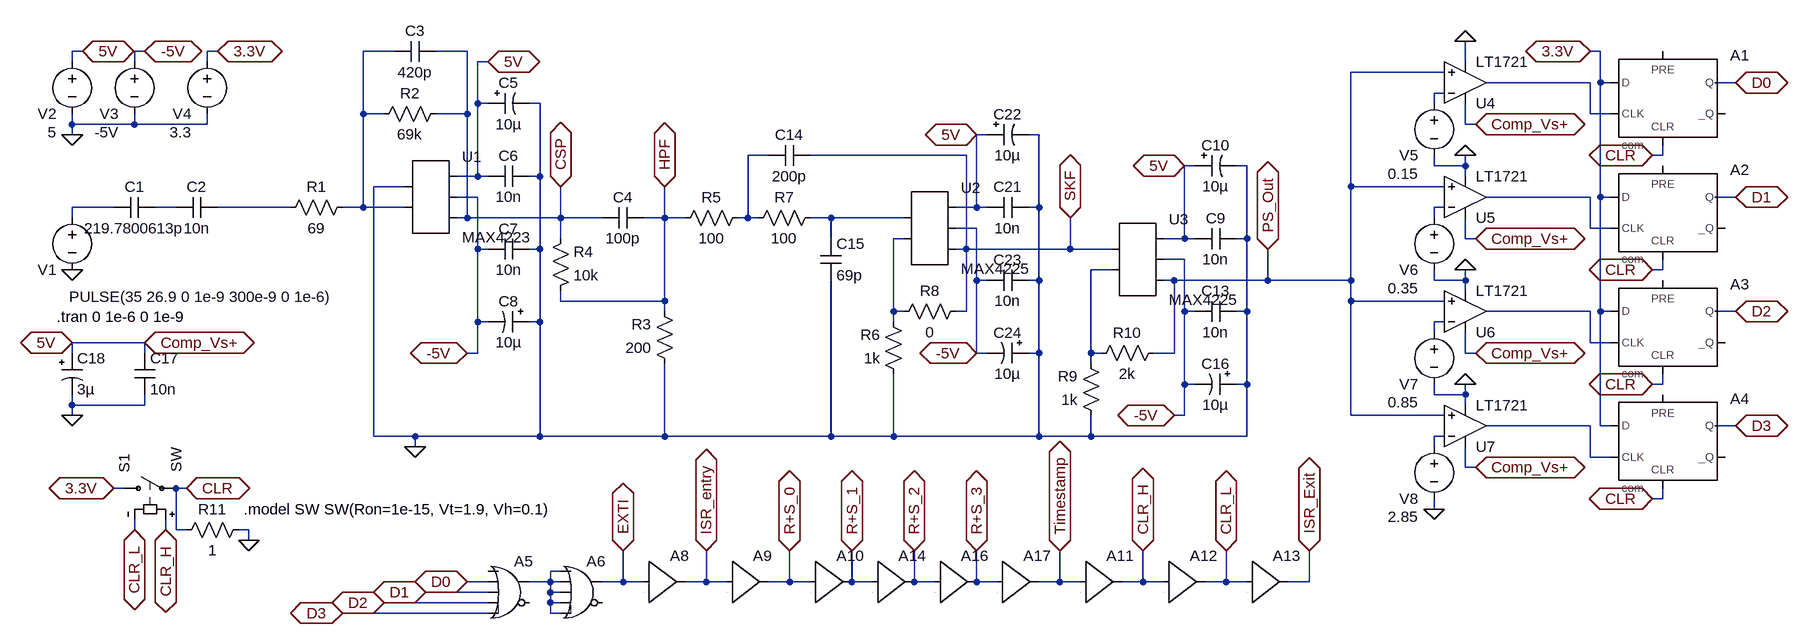
[diagram p0: schematic Radiation_to_OBC.asc]
Radiation_to_OBC.asc, the LTspice schematic file:
Version 4
SHEET 1 8136 1524
WIRE -496 -176 -512 -176
WIRE -400 -176 -416 -176
WIRE -288 -176 -304 -176
WIRE -16 -176 -64 -176
WIRE 96 -176 48 -176
WIRE 1840 -176 1824 -176
WIRE -512 -160 -512 -176
WIRE -416 -160 -416 -176
WIRE -304 -160 -304 -176
WIRE 128 -160 112 -160
WIRE 1632 -160 1632 -192
WIRE 1600 -144 1456 -144
WIRE 1824 -128 1664 -128
WIRE 1840 -128 1840 -176
WIRE 1856 -128 1840 -128
WIRE 2048 -128 2016 -128
WIRE 1600 -112 1584 -112
WIRE 112 -96 112 -160
WIRE 128 -96 112 -96
WIRE 208 -96 192 -96
WIRE 1584 -96 1584 -112
WIRE -64 -80 -64 -176
WIRE -32 -80 -64 -80
WIRE 96 -80 96 -176
WIRE 96 -80 48 -80
WIRE 1824 -80 1824 -128
WIRE 1856 -80 1824 -80
WIRE -512 -64 -512 -80
WIRE -416 -64 -416 -80
WIRE -416 -64 -512 -64
WIRE -304 -64 -304 -80
WIRE -304 -64 -416 -64
WIRE 1632 -64 1632 -96
WIRE 1648 -64 1632 -64
WIRE -512 -48 -512 -64
WIRE 896 -48 880 -48
WIRE 976 -48 960 -48
WIRE 560 -16 528 -16
WIRE 864 -16 624 -16
WIRE 1936 -16 1936 -32
WIRE 1936 -16 1920 -16
WIRE 1216 0 1200 0
WIRE 1296 0 1280 0
WIRE 1584 0 1584 -16
WIRE 1632 0 1632 -16
WIRE 1632 0 1584 0
WIRE 112 16 112 -96
WIRE 112 16 80 16
WIRE 128 16 112 16
WIRE 208 16 208 -96
WIRE 208 16 192 16
WIRE 1632 16 1632 0
WIRE 0 32 -48 32
WIRE 1456 32 1456 -144
WIRE 1600 32 1456 32
WIRE 112 48 80 48
WIRE 1824 48 1664 48
WIRE 1840 48 1840 -128
WIRE 1856 48 1840 48
WIRE 2048 48 2016 48
WIRE -448 64 -512 64
WIRE -352 64 -384 64
WIRE -176 64 -288 64
WIRE -64 64 -64 -80
WIRE -64 64 -96 64
WIRE 0 64 -64 64
WIRE 880 64 880 -48
WIRE 880 64 848 64
WIRE 896 64 880 64
WIRE 976 64 976 -48
WIRE 976 64 960 64
WIRE 1600 64 1584 64
WIRE -512 80 -512 64
WIRE 96 80 96 -80
WIRE 96 80 80 80
WIRE 240 80 240 32
WIRE 240 80 96 80
WIRE 304 80 240 80
WIRE 400 80 400 32
WIRE 400 80 368 80
WIRE 432 80 400 80
WIRE 528 80 528 -16
WIRE 528 80 512 80
WIRE 544 80 528 80
WIRE 656 80 624 80
WIRE 768 80 656 80
WIRE 1584 80 1584 64
WIRE 880 96 848 96
WIRE 1824 96 1824 48
WIRE 1856 96 1824 96
WIRE 240 112 240 80
WIRE 656 112 656 80
WIRE 768 112 752 112
WIRE 1200 112 1200 0
WIRE 1200 112 1168 112
WIRE 1216 112 1200 112
WIRE 1296 112 1296 0
WIRE 1296 112 1280 112
WIRE 1632 112 1632 80
WIRE 1648 112 1632 112
WIRE 112 128 112 48
WIRE 128 128 112 128
WIRE 208 128 208 16
WIRE 208 128 192 128
WIRE 864 128 864 -16
WIRE 864 128 848 128
WIRE 1024 128 1024 80
WIRE 1024 128 864 128
WIRE 1088 128 1024 128
WIRE 1200 144 1168 144
WIRE 1088 160 1056 160
WIRE 1936 160 1936 144
WIRE 1936 160 1920 160
WIRE 880 176 880 96
WIRE 896 176 880 176
WIRE 976 176 976 64
WIRE 976 176 960 176
WIRE 1184 176 1168 176
WIRE 1328 176 1328 128
WIRE 1328 176 1184 176
WIRE 1456 176 1456 32
WIRE 1456 176 1328 176
WIRE 1584 176 1584 160
WIRE 1632 176 1632 160
WIRE 1632 176 1584 176
WIRE 1632 192 1632 176
WIRE 240 208 240 192
WIRE 400 208 400 80
WIRE 400 208 240 208
WIRE 1456 208 1456 176
WIRE 1600 208 1456 208
WIRE 400 224 400 208
WIRE 752 224 752 112
WIRE 768 224 752 224
WIRE 864 224 864 128
WIRE 864 224 848 224
WIRE 1200 224 1200 144
WIRE 1216 224 1200 224
WIRE 1296 224 1296 112
WIRE 1296 224 1280 224
WIRE 1824 224 1664 224
WIRE 1840 224 1840 48
WIRE 1856 224 1840 224
WIRE 2048 224 2016 224
WIRE 112 240 112 128
WIRE 128 240 112 240
WIRE 208 240 208 128
WIRE 208 240 192 240
WIRE 752 240 752 224
WIRE 1600 240 1584 240
WIRE 1584 256 1584 240
WIRE -400 272 -512 272
WIRE 1824 272 1824 224
WIRE 1856 272 1824 272
WIRE -512 288 -512 272
WIRE -400 288 -400 272
WIRE 112 288 112 240
WIRE 112 288 96 288
WIRE 880 288 880 176
WIRE 896 288 880 288
WIRE 976 288 976 176
WIRE 976 288 960 288
WIRE 1056 288 1056 160
WIRE 1072 288 1056 288
WIRE 1184 288 1184 176
WIRE 1184 288 1152 288
WIRE 1632 288 1632 256
WIRE 1648 288 1632 288
WIRE 1056 304 1056 288
WIRE 1200 336 1200 224
WIRE 1216 336 1200 336
WIRE 1296 336 1296 224
WIRE 1296 336 1280 336
WIRE 1936 336 1936 320
WIRE 1936 336 1920 336
WIRE 1584 352 1584 336
WIRE 1632 352 1632 336
WIRE 1632 352 1584 352
WIRE -512 368 -512 352
WIRE -400 368 -400 352
WIRE -400 368 -512 368
WIRE 1632 368 1632 352
WIRE -512 384 -512 368
WIRE 1200 384 1200 336
WIRE 1200 384 1184 384
WIRE 1456 384 1456 208
WIRE 1600 384 1456 384
WIRE 1824 400 1664 400
WIRE 1840 400 1840 224
WIRE 1856 400 1840 400
WIRE 2048 400 2016 400
WIRE -48 416 -48 32
WIRE 16 416 -48 416
WIRE 208 416 208 240
WIRE 208 416 16 416
WIRE 400 416 400 304
WIRE 400 416 208 416
WIRE 656 416 656 176
WIRE 656 416 400 416
WIRE 752 416 752 320
WIRE 752 416 656 416
WIRE 976 416 976 288
WIRE 976 416 752 416
WIRE 1056 416 1056 384
WIRE 1056 416 976 416
WIRE 1296 416 1296 336
WIRE 1296 416 1056 416
WIRE 1600 416 1584 416
WIRE 16 432 16 416
WIRE 1584 432 1584 416
WIRE 1824 448 1824 400
WIRE 1856 448 1824 448
WIRE 1632 464 1632 432
WIRE 1648 464 1632 464
WIRE -432 496 -448 496
WIRE -336 496 -352 496
WIRE 1936 512 1936 496
WIRE 1936 512 1920 512
WIRE 1584 528 1584 512
WIRE -416 560 -416 544
WIRE -368 560 -368 544
WIRE -352 560 -352 496
WIRE -336 560 -352 560
WIRE -240 560 -256 560
WIRE -240 576 -240 560
WIRE 240 624 224 624
WIRE 128 640 96 640
WIRE 224 640 224 624
WIRE 224 640 192 640
WIRE 240 640 224 640
WIRE 336 640 336 592
WIRE 336 640 304 640
WIRE 368 640 336 640
WIRE 464 640 464 592
WIRE 464 640 432 640
WIRE 496 640 464 640
WIRE 592 640 592 592
WIRE 592 640 560 640
WIRE 624 640 592 640
WIRE 688 640 688 592
WIRE 720 640 688 640
WIRE 784 640 784 592
WIRE 816 640 784 640
WIRE 880 640 880 592
WIRE 912 640 880 640
WIRE 1008 640 1008 592
WIRE 1008 640 976 640
WIRE 1040 640 1008 640
WIRE 1136 640 1136 592
WIRE 1136 640 1104 640
WIRE 1168 640 1136 640
WIRE 1264 640 1264 592
WIRE 1264 640 1232 640
WIRE 1296 640 1264 640
WIRE 1392 640 1392 592
WIRE 1392 640 1360 640
WIRE 128 656 32 656
WIRE 224 656 224 640
WIRE 240 656 224 656
WIRE 128 672 -32 672
WIRE 224 672 224 656
WIRE 240 672 224 672
WIRE 128 688 -96 688
WIRE 224 688 224 672
WIRE 240 688 224 688
FLAG -512 -48 0
FLAG -512 160 0
FLAG 16 432 0
FLAG 1328 128 PS_Out
IOPIN 1328 128 BiDir
FLAG 400 32 HPF
IOPIN 400 32 BiDir
FLAG 1024 80 SKF
IOPIN 1024 80 BiDir
FLAG -496 -176 5V
IOPIN -496 -176 BiDir
FLAG -400 -176 -5V
IOPIN -400 -176 BiDir
FLAG -288 -176 3.3V
IOPIN -288 -176 BiDir
FLAG 96 288 -5V
IOPIN 96 288 BiDir
FLAG 880 288 -5V
IOPIN 880 288 BiDir
FLAG 1184 384 -5V
IOPIN 1184 384 BiDir
FLAG 880 -48 5V
IOPIN 880 -48 BiDir
FLAG 1200 0 5V
IOPIN 1200 0 BiDir
FLAG 128 -160 5V
IOPIN 128 -160 BiDir
FLAG -512 272 5V
IOPIN -512 272 BiDir
FLAG -512 384 0
FLAG -400 272 Comp_Vs+
IOPIN -400 272 BiDir
FLAG 1648 -64 Comp_Vs+
IOPIN 1648 -64 BiDir
FLAG 1648 112 Comp_Vs+
IOPIN 1648 112 BiDir
FLAG 1648 288 Comp_Vs+
IOPIN 1648 288 BiDir
FLAG 1648 464 Comp_Vs+
IOPIN 1648 464 BiDir
FLAG 1584 528 0
FLAG 1632 -16 0
FLAG 1632 160 0
FLAG 1632 336 0
FLAG 240 32 CSP
IOPIN 240 32 BiDir
FLAG 1824 -176 3.3V
IOPIN 1824 -176 BiDir
FLAG 1920 -16 CLR
IOPIN 1920 -16 BiDir
FLAG 1920 160 CLR
IOPIN 1920 160 BiDir
FLAG 1920 336 CLR
IOPIN 1920 336 BiDir
FLAG 1920 512 CLR
IOPIN 1920 512 BiDir
FLAG 336 592 EXTI
IOPIN 336 592 BiDir
FLAG 464 592 ISR_entry
IOPIN 464 592 BiDir
FLAG -448 496 3.3V
IOPIN -448 496 BiDir
FLAG 592 592 R+S_0
IOPIN 592 592 BiDir
FLAG 1008 592 Timestamp
IOPIN 1008 592 BiDir
FLAG -240 576 0
FLAG -336 496 CLR
IOPIN -336 496 BiDir
FLAG -368 560 CLR_H
IOPIN -368 560 BiDir
FLAG 1136 592 CLR_H
IOPIN 1136 592 BiDir
FLAG -416 560 CLR_L
IOPIN -416 560 BiDir
FLAG 1264 592 CLR_L
IOPIN 1264 592 BiDir
FLAG 1392 592 ISR_Exit
IOPIN 1392 592 BiDir
FLAG 1632 -192 0
FLAG 688 592 R+S_1
IOPIN 688 592 BiDir
FLAG 784 592 R+S_2
IOPIN 784 592 BiDir
FLAG 880 592 R+S_3
IOPIN 880 592 BiDir
FLAG 2048 -128 D0
IOPIN 2048 -128 BiDir
FLAG 2048 48 D1
IOPIN 2048 48 BiDir
FLAG 2048 224 D2
IOPIN 2048 224 BiDir
FLAG 2048 400 D3
IOPIN 2048 400 BiDir
FLAG -96 688 D3
IOPIN -96 688 BiDir
FLAG -32 672 D2
IOPIN -32 672 BiDir
FLAG 32 656 D1
IOPIN 32 656 BiDir
FLAG 96 640 D0
IOPIN 96 640 BiDir
SYMBOL res -80 48 R90
WINDOW 0 0 56 VBottom 2
WINDOW 3 32 56 VTop 2
SYMATTR InstName R1
SYMATTR Value 69
SYMBOL cap -384 48 R90
WINDOW 0 0 32 VBottom 2
WINDOW 3 32 32 VTop 2
SYMATTR InstName C1
SYMATTR Value 219.7800613p
SYMBOL voltage -512 -176 M0
WINDOW 0 24 96 Left 2
WINDOW 3 24 124 Left 2
WINDOW 123 0 0 Left 2
WINDOW 39 24 152 Left 2
SYMATTR InstName V2
SYMATTR Value 5
SYMBOL res 64 -96 R90
WINDOW 0 0 56 VBottom 2
WINDOW 3 32 56 VTop 2
SYMATTR InstName R2
SYMATTR Value 69k
SYMBOL cap 48 -192 R90
WINDOW 0 0 32 VBottom 2
WINDOW 3 32 32 VTop 2
SYMATTR InstName C3
SYMATTR Value 420p
SYMBOL voltage -512 64 M0
WINDOW 0 24 96 Left 2
WINDOW 3 -405 137 Left 2
WINDOW 123 24 152 Left 2
WINDOW 39 24 152 Left 2
SYMATTR InstName V1
SYMATTR Value PULSE(35 26.9 0 1e-9 300e-9 0 1e-6)
SYMBOL cap -288 48 R90
WINDOW 0 0 32 VBottom 2
WINDOW 3 32 32 VTop 2
SYMATTR InstName C2
SYMATTR Value 10n
SYMBOL cap 192 0 R90
WINDOW 0 0 32 VBottom 2
WINDOW 3 32 32 VTop 2
SYMATTR InstName C6
SYMATTR Value 10n
SYMBOL cap 192 144 M270
WINDOW 0 32 32 VTop 2
WINDOW 3 0 32 VBottom 2
SYMATTR InstName C7
SYMATTR Value 10n
SYMBOL polcap 128 -112 M90
WINDOW 0 0 32 VBottom 2
WINDOW 3 32 32 VTop 2
SYMATTR InstName C5
SYMATTR Value 10µ
SYMBOL polcap 192 224 R90
WINDOW 0 0 32 VBottom 2
WINDOW 3 32 32 VTop 2
SYMATTR InstName C8
SYMATTR Value 10µ
SYMBOL res 416 320 R180
WINDOW 0 36 76 Left 2
WINDOW 3 36 40 Left 2
SYMATTR InstName R3
SYMATTR Value 200
SYMBOL cap 368 64 R90
WINDOW 0 0 32 VBottom 2
WINDOW 3 32 32 VTop 2
SYMATTR InstName C4
SYMATTR Value 100p
SYMBOL res 528 64 R90
WINDOW 0 0 56 VBottom 2
WINDOW 3 32 56 VTop 2
SYMATTR InstName R5
SYMATTR Value 100
SYMBOL res 768 336 R180
WINDOW 0 36 76 Left 2
WINDOW 3 36 40 Left 2
SYMATTR InstName R6
SYMATTR Value 1k
SYMBOL cap 624 -32 R90
WINDOW 0 0 32 VBottom 2
WINDOW 3 32 32 VTop 2
SYMATTR InstName C14
SYMATTR Value 200p
SYMBOL res 640 64 R90
WINDOW 0 0 56 VBottom 2
WINDOW 3 32 56 VTop 2
SYMATTR InstName R7
SYMATTR Value 100
SYMBOL cap 640 112 R0
SYMATTR InstName C15
SYMATTR Value 69p
SYMBOL AutoGenerated\\MAX4225 800 96 R0
SYMATTR InstName U2
SYMBOL res 752 240 R270
WINDOW 0 32 56 VTop 2
WINDOW 3 0 56 VBottom 2
SYMATTR InstName R8
SYMATTR Value 0
SYMBOL cap 960 48 R90
WINDOW 0 0 32 VBottom 2
WINDOW 3 32 32 VTop 2
SYMATTR InstName C21
SYMATTR Value 10n
SYMBOL polcap 896 -64 M90
WINDOW 0 0 32 VBottom 2
WINDOW 3 32 32 VTop 2
SYMATTR InstName C22
SYMATTR Value 10µ
SYMBOL cap 960 192 M270
WINDOW 0 32 32 VTop 2
WINDOW 3 0 32 VBottom 2
SYMATTR InstName C23
SYMATTR Value 10n
SYMBOL polcap 960 272 R90
WINDOW 0 0 32 VBottom 2
WINDOW 3 32 32 VTop 2
SYMATTR InstName C24
SYMATTR Value 10µ
SYMBOL res 224 208 M180
WINDOW 0 36 76 Left 2
WINDOW 3 36 40 Left 2
SYMATTR InstName R4
SYMATTR Value 10k
SYMBOL cap 1280 96 R90
WINDOW 0 0 32 VBottom 2
WINDOW 3 32 32 VTop 2
SYMATTR InstName C9
SYMATTR Value 10n
SYMBOL polcap 1216 -16 M90
WINDOW 0 0 32 VBottom 2
WINDOW 3 32 32 VTop 2
SYMATTR InstName C10
SYMATTR Value 10µ
SYMBOL cap 1280 240 M270
WINDOW 0 32 32 VTop 2
WINDOW 3 0 32 VBottom 2
SYMATTR InstName C13
SYMATTR Value 10n
SYMBOL polcap 1280 320 R90
WINDOW 0 0 32 VBottom 2
WINDOW 3 32 32 VTop 2
SYMATTR InstName C16
SYMATTR Value 10µ
SYMBOL AutoGenerated\\MAX4225 1120 144 R0
SYMATTR InstName U3
SYMBOL res 1072 400 R180
WINDOW 0 36 76 Left 2
WINDOW 3 36 40 Left 2
SYMATTR InstName R9
SYMATTR Value 1k
SYMBOL res 1056 304 R270
WINDOW 0 32 56 VTop 2
WINDOW 3 0 56 VBottom 2
SYMATTR InstName R10
SYMATTR Value 2k
SYMBOL Comparators\\LT1721 1632 -64 M180
SYMATTR InstName U4
SYMBOL AutoGenerated\\MAX4223 32 48 R0
SYMATTR InstName U1
SYMBOL Digital\\or 160 592 R0
WINDOW 3 0 0 Invisible 0
SYMATTR Value Vhigh=2.5, Vlow=0.4, Ref=1.15
SYMATTR InstName A5
SYMATTR Value2 Trise=1.5e-9, Td=6e-9, Cout=3e-12
SYMBOL voltage -416 -176 M0
WINDOW 0 24 96 Left 2
WINDOW 3 24 124 Left 2
WINDOW 123 0 0 Left 2
WINDOW 39 24 152 Left 2
SYMATTR InstName V3
SYMATTR Value -5V
SYMBOL voltage -304 -176 M0
WINDOW 0 24 96 Left 2
WINDOW 3 24 124 Left 2
WINDOW 123 0 0 Left 2
WINDOW 39 24 152 Left 2
SYMATTR InstName V4
SYMATTR Value 3.3
SYMBOL cap -416 352 M180
WINDOW 0 24 56 Left 2
WINDOW 3 24 8 Left 2
SYMATTR InstName C17
SYMATTR Value 10n
SYMBOL polcap -528 288 R0
SYMATTR InstName C18
SYMATTR Value 3µ
SYMBOL voltage 1584 -112 M0
WINDOW 0 24 96 Left 2
WINDOW 3 24 124 Left 2
WINDOW 123 0 0 Left 2
WINDOW 39 24 152 Left 2
SYMATTR InstName V5
SYMATTR Value 0.15
SYMBOL Comparators\\LT1721 1632 112 M180
SYMATTR InstName U5
SYMBOL voltage 1584 64 M0
WINDOW 0 24 96 Left 2
WINDOW 3 24 124 Left 2
WINDOW 123 0 0 Left 2
WINDOW 39 24 152 Left 2
SYMATTR InstName V6
SYMATTR Value 0.35
SYMBOL Comparators\\LT1721 1632 288 M180
SYMATTR InstName U6
SYMBOL voltage 1584 240 M0
WINDOW 0 24 96 Left 2
WINDOW 3 24 124 Left 2
WINDOW 123 0 0 Left 2
WINDOW 39 24 152 Left 2
SYMATTR InstName V7
SYMATTR Value 0.85
SYMBOL Comparators\\LT1721 1632 464 M180
SYMATTR InstName U7
SYMBOL voltage 1584 416 M0
WINDOW 0 24 96 Left 2
WINDOW 3 24 124 Left 2
WINDOW 123 0 0 Left 2
WINDOW 39 24 152 Left 2
SYMATTR InstName V8
SYMATTR Value 2.85
SYMBOL Digital\\dflop 1936 -176 R0
WINDOW 3 0 0 Invisible 0
SYMATTR Value Vhigh=2.4, Vlow=0.4, Ref=2
SYMATTR InstName A1
SYMATTR Value2 Trise=1.2e-9, Td=6e-9
SYMBOL Digital\\dflop 1936 0 R0
WINDOW 3 0 0 Invisible 0
SYMATTR Value Vhigh=2.4, Vlow=0.4, Ref=2
SYMATTR InstName A2
SYMATTR Value2 Trise=1.2e-9, Td=6e-9
SYMBOL Digital\\dflop 1936 176 R0
WINDOW 3 0 0 Invisible 0
SYMATTR Value Vhigh=2.4, Vlow=0.4, Ref=2
SYMATTR InstName A3
SYMATTR Value2 Trise=1.2e-9, Td=6e-9
SYMBOL Digital\\dflop 1936 352 R0
WINDOW 3 0 0 Invisible 0
SYMATTR Value Vhigh=2.4, Vlow=0.4, Ref=2
SYMATTR InstName A4
SYMATTR Value2 Trise=1.2e-9, Td=6e-9
SYMBOL Digital\\buf1 368 576 R0
WINDOW 3 0 0 Invisible 0
SYMATTR Value Vhigh=4.9, Vlow=-0.4, Ref=1.9
SYMATTR InstName A8
SYMATTR Value2 Trise=1e-15, Td=375e-9
SYMBOL Digital\\buf1 624 576 R0
WINDOW 3 0 0 Invisible 0
SYMATTR Value Vhigh=3.3, Vlow=0.0, Ref=1e-6
SYMATTR InstName A10
SYMATTR Value2 Trise=0,Td=31.25e-9
SYMBOL sw -448 496 R270
SYMATTR InstName S1
SYMBOL res -352 576 R270
WINDOW 0 32 56 VTop 2
WINDOW 3 0 56 VBottom 2
SYMATTR InstName R11
SYMATTR Value 1
SYMBOL Digital\\buf1 496 576 R0
WINDOW 3 0 0 Invisible 0
SYMATTR Value Vhigh=3.3, Vlow=0.0, Ref=1e-6
SYMATTR InstName A9
SYMATTR Value2 Trise=0, Td=31.25e-9
SYMBOL Digital\\buf1 1040 576 R0
WINDOW 3 0 0 Invisible 0
SYMATTR Value Vhigh=3.3, Vlow=0.0, Ref=1e-6
SYMATTR InstName A11
SYMATTR Value2 Trise=10e-9, Td=31.25e-9
SYMBOL Digital\\buf1 1168 576 R0
WINDOW 3 0 0 Invisible 0
SYMATTR Value Vhigh=3.3, Vlow=0.0, Ref=1.9
SYMATTR InstName A12
SYMATTR Value2 Trise=10e-9, Td=31.25e-9
SYMBOL Digital\\buf1 1296 576 R0
WINDOW 3 0 0 Invisible 0
SYMATTR Value Vhigh=4.9, Vlow=-0.4, Ref=1.9
SYMATTR InstName A13
SYMATTR Value2 Trise=0, Td=312.5e-9
SYMBOL Digital\\or 272 592 R0
WINDOW 3 0 0 Invisible 0
SYMATTR Value Vhigh=2.5, Vlow=0.4, Ref=1.15
SYMATTR InstName A6
SYMATTR Value2 Trise=1.5e-9, Td=6e-9, Cout=3e-12
SYMBOL Digital\\buf1 720 576 R0
WINDOW 3 0 0 Invisible 0
SYMATTR Value Vhigh=3.3, Vlow=0.0, Ref=1e-6
SYMATTR InstName A14
SYMATTR Value2 Trise=0,Td=31.25e-9
SYMBOL Digital\\buf1 816 576 R0
WINDOW 3 0 0 Invisible 0
SYMATTR Value Vhigh=3.3, Vlow=0.0, Ref=1e-6
SYMATTR InstName A16
SYMATTR Value2 Trise=0,Td=31.25e-9
SYMBOL Digital\\buf1 912 576 R0
WINDOW 3 0 0 Invisible 0
SYMATTR Value Vhigh=3.3, Vlow=0.0, Ref=1e-6
SYMATTR InstName A17
SYMATTR Value2 Trise=0,Td=31.25e-9
TEXT -536 232 Left 2 !.tran 0 1e-6 0 1e-9
TEXT -248 528 Left 2 !.model SW SW(Ron=1e-15, Vt=1.9, Vh=0.1)

The netlist it stands for:
* Radiation_to_OBC.asc
R1 N001 N008 69
C1 N007 N006 219.7800613p
V2 Comp_Vs+ 0 5
R2 CSP N001 69k
C3 CSP N001 420p
V1 N006 0 PULSE(35 26.9 0 1e-9 300e-9 0 1e-6)
C2 N008 N007 10n
C6 0 Comp_Vs+ 10n
C7 0 -5V 10n
C5 Comp_Vs+ 0 10µ
C8 0 -5V 10µ
R3 0 HPF 200
C4 HPF CSP 100p
R5 N004 HPF 100
R6 0 N011 1k
C14 SKF N004 200p
R7 N010 N004 100
C15 N010 0 69p
* U2: MAX4225 (symbol AutoGenerated\MAX4225 not available, pins judged from their places): pin1=N010 pin2=N011 pin3=Comp_Vs+ pin4=-5V pin5=SKF
R8 N011 SKF 0
C21 0 Comp_Vs+ 10n
C22 Comp_Vs+ 0 10µ
C23 0 -5V 10n
C24 0 -5V 10µ
R4 HPF CSP 10k
C9 0 Comp_Vs+ 10n
C10 Comp_Vs+ 0 10µ
C13 0 -5V 10n
C16 0 -5V 10µ
* U3: MAX4225 (symbol AutoGenerated\MAX4225 not available, pins judged from their places): pin1=SKF pin2=N012 pin3=Comp_Vs+ pin4=-5V pin5=PS_Out
R9 0 N012 1k
R10 N012 PS_Out 2k
XU4 PS_Out N003 Comp_Vs+ 0 N002 LT1720  ; LT1721, pins In+ In- V+ V- OUT
* U1: MAX4223 (symbol AutoGenerated\MAX4223 not available, pins judged from their places): pin1=0 pin2=N001 pin3=Comp_Vs+ pin4=-5V pin5=CSP
A5 0 D0 D1 D2 D3 0 N017 0 OR Vhigh=2.5, Vlow=0.4, Ref=1.15 Trise=1.5e-9, Td=6e-9, Cout=3e-12
V3 -5V 0 -5V
V4 3.3V 0 3.3
C17 0 Comp_Vs+ 10n
C18 Comp_Vs+ 0 3µ
V5 N003 0 0.15
XU5 PS_Out N009 Comp_Vs+ 0 N005 LT1720  ; LT1721, pins In+ In- V+ V- OUT
V6 N009 0 0.35
XU6 PS_Out N014 Comp_Vs+ 0 N013 LT1720  ; LT1721, pins In+ In- V+ V- OUT
V7 N014 0 0.85
XU7 PS_Out N016 Comp_Vs+ 0 N015 LT1720  ; LT1721, pins In+ In- V+ V- OUT
V8 N016 0 2.85
A1 3.3V 0 N002 0 CLR 0 D0 0 DFLOP Vhigh=2.4, Vlow=0.4, Ref=2 Trise=1.2e-9, Td=6e-9
A2 3.3V 0 N005 0 CLR 0 D1 0 DFLOP Vhigh=2.4, Vlow=0.4, Ref=2 Trise=1.2e-9, Td=6e-9
A3 3.3V 0 N013 0 CLR 0 D2 0 DFLOP Vhigh=2.4, Vlow=0.4, Ref=2 Trise=1.2e-9, Td=6e-9
A4 3.3V 0 N015 0 CLR 0 D3 0 DFLOP Vhigh=2.4, Vlow=0.4, Ref=2 Trise=1.2e-9, Td=6e-9
A8 EXTI 0 0 0 0 0 ISR_entry 0 BUF Vhigh=4.9, Vlow=-0.4, Ref=1.9 Trise=1e-15, Td=375e-9
A10 R+S_0 0 0 0 0 0 R+S_1 0 BUF Vhigh=3.3, Vlow=0.0, Ref=1e-6 Trise=0,Td=31.25e-9
S1 3.3V CLR CLR_H CLR_L SW
R11 CLR 0 1
A9 ISR_entry 0 0 0 0 0 R+S_0 0 BUF Vhigh=3.3, Vlow=0.0, Ref=1e-6 Trise=0, Td=31.25e-9
A11 Timestamp 0 0 0 0 0 CLR_H 0 BUF Vhigh=3.3, Vlow=0.0, Ref=1e-6 Trise=10e-9, Td=31.25e-9
A12 CLR_H 0 0 0 0 0 CLR_L 0 BUF Vhigh=3.3, Vlow=0.0, Ref=1.9 Trise=10e-9, Td=31.25e-9
A13 CLR_L 0 0 0 0 0 ISR_Exit 0 BUF Vhigh=4.9, Vlow=-0.4, Ref=1.9 Trise=0, Td=312.5e-9
A6 N017 N017 N017 N017 N017 0 EXTI 0 OR Vhigh=2.5, Vlow=0.4, Ref=1.15 Trise=1.5e-9, Td=6e-9, Cout=3e-12
A14 R+S_1 0 0 0 0 0 R+S_2 0 BUF Vhigh=3.3, Vlow=0.0, Ref=1e-6 Trise=0,Td=31.25e-9
A16 R+S_2 0 0 0 0 0 R+S_3 0 BUF Vhigh=3.3, Vlow=0.0, Ref=1e-6 Trise=0,Td=31.25e-9
A17 R+S_3 0 0 0 0 0 Timestamp 0 BUF Vhigh=3.3, Vlow=0.0, Ref=1e-6 Trise=0,Td=31.25e-9
.tran 0 1e-6 0 1e-9
.model SW SW(Ron=1e-15, Vt=1.9, Vh=0.1)
.lib LTC.lib
.backanno
.end